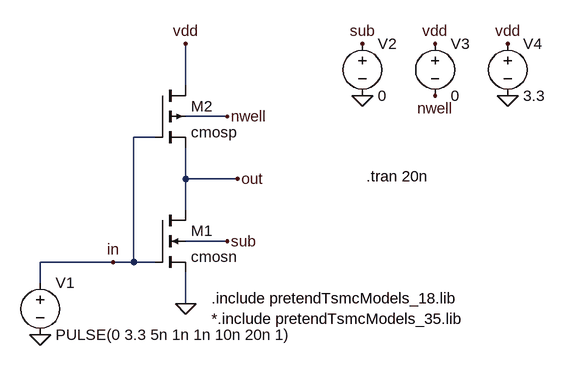
[diagram p0: schematic tsmcInverter.asc]
tsmcInverter.asc, the LTspice schematic file:
Version 4
SHEET 1 1056 680
WIRE -160 272 -160 240
WIRE -48 240 -160 240
WIRE -16 240 -48 240
WIRE -16 240 -16 48
WIRE 16 48 -16 48
WIRE 16 240 -16 240
WIRE 64 -32 64 -96
WIRE 64 112 64 64
WIRE 64 160 64 112
WIRE 64 304 64 256
WIRE 128 16 64 16
WIRE 128 208 64 208
WIRE 144 112 64 112
FLAG 128 208 sub
FLAG 64 -96 vdd
FLAG 64 304 0
FLAG 144 112 out
FLAG -48 240 in
FLAG 128 16 nwell
FLAG 336 -16 0
FLAG 336 -96 sub
FLAG 448 -96 vdd
FLAG 448 -16 nwell
FLAG -160 352 0
FLAG 560 -96 vdd
FLAG 560 -16 0
SYMBOL nmos4 16 160 R0
SYMATTR InstName M1
SYMATTR Value cmosn
SYMATTR Value2 l=0.18u w=1.4u
SYMBOL pmos4 16 -32 R0
SYMATTR InstName M2
SYMATTR Value cmosp
SYMATTR Value2 l=0.18u w=2.8u
SYMBOL voltage -160 256 R0
WINDOW 123 0 0 Left 0
WINDOW 39 0 0 Left 0
SYMATTR InstName V1
SYMATTR Value PULSE(0 3.3 5n 1n 1n 10n 20n 1)
SYMBOL voltage 336 -112 R0
WINDOW 123 0 0 Left 0
WINDOW 39 0 0 Left 0
SYMATTR InstName V2
SYMATTR Value 0
SYMBOL voltage 448 -112 R0
WINDOW 123 0 0 Left 0
WINDOW 39 0 0 Left 0
SYMATTR InstName V3
SYMATTR Value 0
SYMBOL voltage 560 -112 R0
WINDOW 123 0 0 Left 0
WINDOW 39 0 0 Left 0
SYMATTR InstName V4
SYMATTR Value 3.3
TEXT 104 296 Left 0 !.include pretendTsmcModels_18.lib\n*.include pretendTsmcModels_35.lib
TEXT 342 108 Left 0 !.tran 20n

The netlist it stands for:
* tsmcInverter.asc
M1 out in 0 sub cmosn l=0.18u w=1.4u
M2 vdd in out nwell cmosp l=0.18u w=2.8u
V1 in 0 PULSE(0 3.3 5n 1n 1n 10n 20n 1)
V2 sub 0 0
V3 vdd nwell 0
V4 vdd 0 3.3
.model NMOS NMOS
.model PMOS PMOS
.lib standard.mos
.include pretendTsmcModels_18.lib
*.include pretendTsmcModels_35.lib
.tran 20n
.backanno
.end